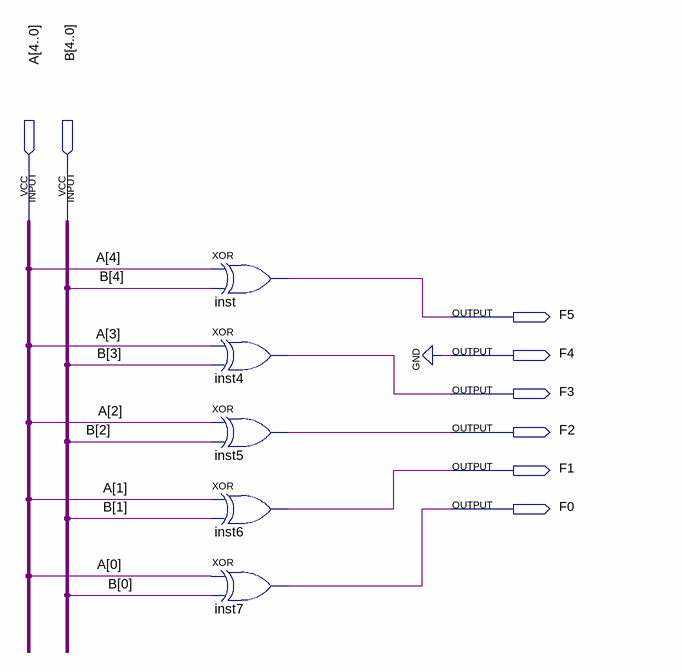
[diagram p0: schematic sheet]
// Quartus schematic modulo_XOR.bdf as structural Verilog: 5 symbols, 8 pins
module modulo_XOR (
  input  [4:0] A,
  input  [4:0] B,
  output F5,
  output F4,
  output F3,
  output F2,
  output F1,
  output F0
);

  xor inst (F5, A[4], B[4]);
  xor inst4 (F3, A[3], B[3]);
  xor inst5 (F2, A[2], B[2]);
  xor inst6 (F1, A[1], B[1]);
  xor inst7 (F0, A[0], B[0]);

  assign F4 = 1'b0;
endmodule
